# EAGLE design 617_jetracer_mini (EAGLE 9.6.2)
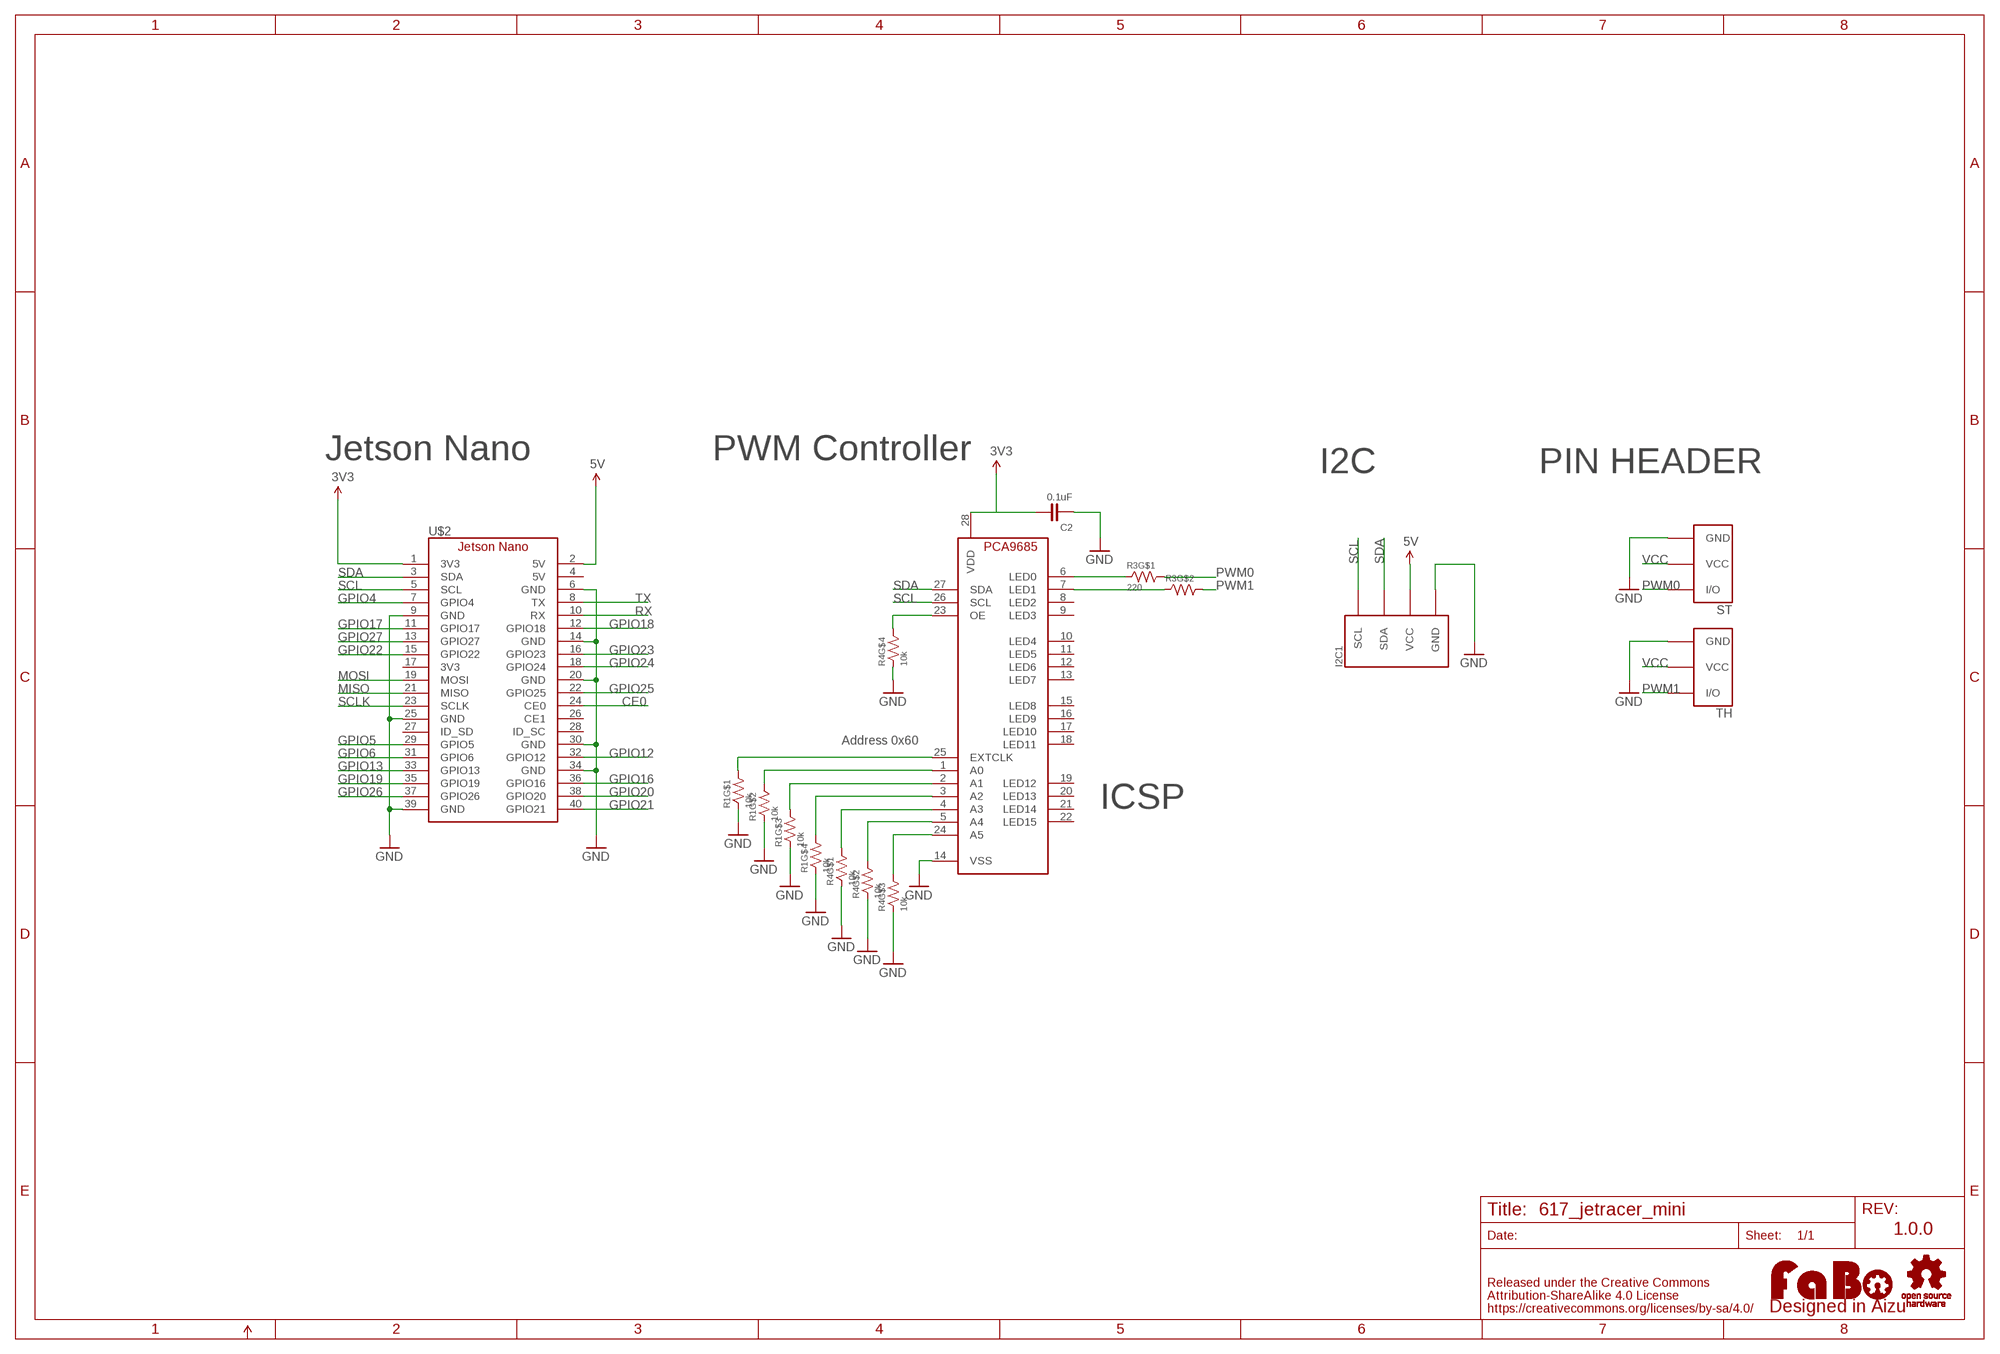
[diagram p0: schematic, sheet 1]

## Parts
C2  0.1uF  CAPACITOR-0603  [0603]
I2C1  FABO_BRICK_I2C-S04B-PASK-2  [FABO_BRICK_I2C_S04B-PASK-2]
LOGO1  LOGO_FABO-M  [LOGO_FABO_M]
R1  10k  RESISTOR_ARRAY  [EXBV8V]
R3  220  RESISTOR_ARRAY  [EXBV8V]
R4  10k  RESISTOR_ARRAY  [EXBV8V]
ST  FABO_BRICK_3PIN-HEADER  [FABO_BRICK_3PIN_HEADER]
TH  FABO_BRICK_3PIN-HEADER  [FABO_BRICK_3PIN_HEADER]
U$2  JETSON_NANO_NOBORDER  [JETSON_NANO_NOBOARDER]
U$3  PCA9685  [PCA9685]
U$5  LOGO_OSHW-M_BOTTOM  [LOGO_OSHW_M_BOTTOM]

## Nets
3V3: C2.2 U$2.1(3V3) U$3.28(VDD)
5V: I2C1.VCC U$2.2(5V)
CE0: U$2.24(CE0)
GND: C2.1 I2C1.GND R1.1 R1.2 R1.3 R1.4 R4.1 R4.2 R4.3 R4.4 ST.GND TH.GND U$2.6(GND) U$2.9(GND) U$2.14(GND) U$2.20(GND) U$2.25(GND) U$2.30(GND) U$2.34(GND) U$2.39(GND) U$3.14(VSS)
GPIO4: U$2.7(GPIO4)
GPIO5: U$2.29(GPIO5)
GPIO6: U$2.31(GPIO6)
GPIO12: U$2.32(GPIO12)
GPIO13: U$2.33(GPIO13)
GPIO16: U$2.36(GPIO16)
GPIO17: U$2.11(GPIO17)
GPIO18: U$2.12(GPIO18)
GPIO19: U$2.35(GPIO19)
GPIO20: U$2.38(GPIO20)
GPIO21: U$2.40(GPIO21)
GPIO22: U$2.15(GPIO22)
GPIO23: U$2.16(GPIO23)
GPIO24: U$2.18(GPIO24)
GPIO25: U$2.22(GPIO25)
GPIO26: U$2.37(GPIO26)
GPIO27: U$2.13(GPIO27)
MISO: U$2.21(MISO)
MOSI: U$2.19(MOSI)
N$2: R3.1 U$3.6(LED0)
N$3: R3.2 U$3.7(LED1)
N$7: R4.5 U$3.23(OE)
N$8: R1.8 U$3.25(EXTCLK)
N$9: R1.7 U$3.1(A0)
N$10: R1.6 U$3.2(A1)
N$11: R1.5 U$3.3(A2)
N$12: R4.8 U$3.4(A3)
N$13: R4.7 U$3.5(A4)
N$14: R4.6 U$3.24(A5)
PWM0: R3.8 ST.I/O
PWM1: R3.7 TH.I/O
RX: U$2.10(RX)
SCL: I2C1.SCL U$2.5(SCL) U$3.26(SCL)
SCLK: U$2.23(SCLK)
SDA: I2C1.SDA U$2.3(SDA) U$3.27(SDA)
TX: U$2.8(TX)
VCC: ST.VCC TH.VCC
Unconnected: R3.3 R3.4 R3.5 R3.6 U$2.4(5V) U$2.17(3V3) U$2.26(CE1) U$2.27(ID_SD) U$2.28(ID_SC) U$3.8(LED2) U$3.9(LED3) U$3.10(LED4) U$3.11(LED5) U$3.12(LED6) U$3.13(LED7) U$3.15(LED8) U$3.16(LED9) U$3.17(LED10) U$3.18(LED11) U$3.19(LED12) U$3.20(LED13) U$3.21(LED14) U$3.22(LED15)

## Notes on the sheet
- Jetson Nano | PWM Controller
- I2C | PIN HEADER
- Address 0x60
- ICSP
- 1.0.0

## Library data of the parts
C2 = FaBo-Capacitor:CAPACITOR: CAPACITOR
I2C1 = FaBo-Template:FABO_BRICK_I2C: FaBo Brick I2C
LOGO1 = component:LOGO_FABO
R1 R3 R4 = component:RESISTOR_ARRAY
ST TH = FaBo-Template:FABO_BRICK_3PIN: FaBo Brick 3pin
U$2 = FaBo-Boards:JETSON_NANO
U$3 = FaBo-Motor:PCA9685
U$5 = component:LOGO_OSHW

## Board
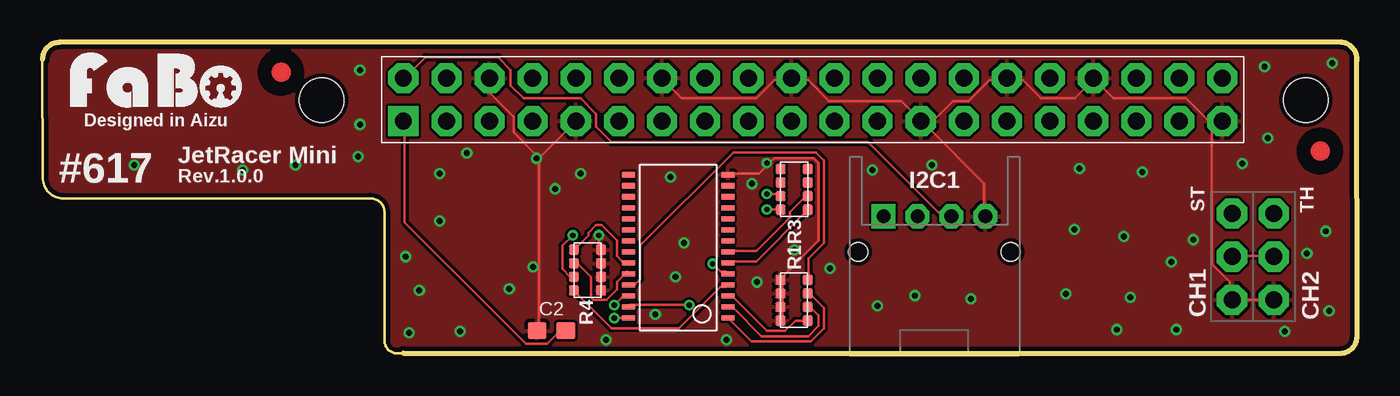
[diagram p1: board, top side]
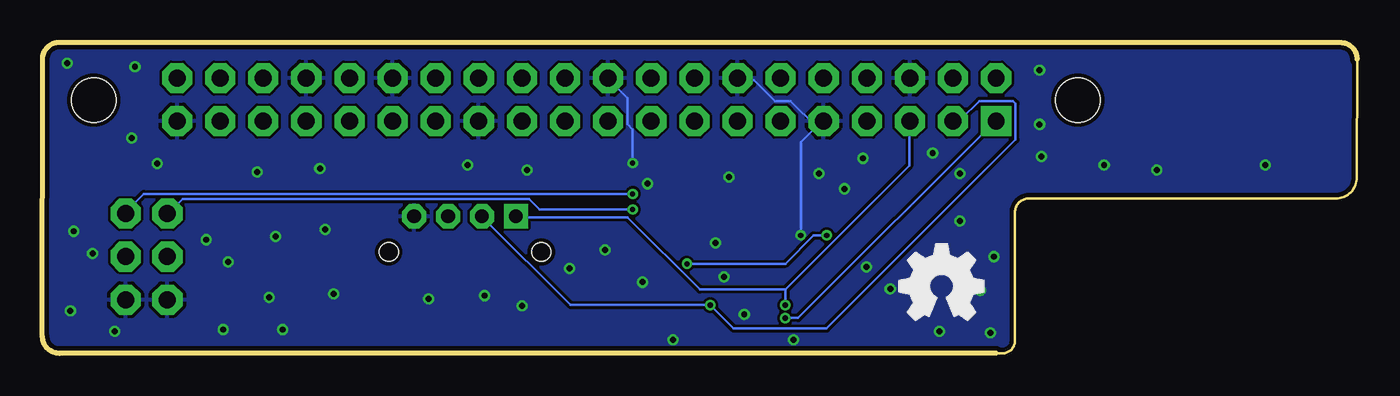
[diagram p2: board, bottom side, seen from below]

Size 77.46 x 18.34 mm. Coordinates in mm from the lower left corner, seen from the top.
Outline: 21.26,0 76.46,0 arc90 77.46,1 77.45,17.28 arc90 76.55,18.34 1,18.34 arc90 0,17.34 0.01,10.38 arc90 1.25,9.13 19.33,9.13 arc-90 20.16,8.31 20.16,0.73 arc90 20.89,0 21.41,0
Copper layers (1*16): Top 0.035mm / dielectric 1.6mm / Bottom 0.035mm
Design rules "PCBway": minimum track width 6mil, minimum drill 12mil, track to track 6mil, track to pad 6mil, pad to pad 6mil, via to via 6mil, smd to smd 6mil, copper to edge 10mil, drill to drill 10mil, minimum pad ring 10mil, minimum via ring 6mil, stop-mask expansion 2mil, vias tented up to drill 100mil, thermal gap 8mil
Holes 2.6 mm at 16.45,14.93 74.44,14.93

### Footprints (pad centres in the part's own frame; a part is rotated, then mirrored left to right if it is on the bottom)
0603 = smd 1.1 x 1: 1 -0.85,0; 2 0.85,0
FABO_BRICK_I2C_S04B-PASK-2 = drill 0.8 pad 1.422 octagon: GND -3,0; SDA 1,0; VCC -1,0 | drill 0.8 pad 1.422 square: SCL 3,0 | hole 1.1: 4.5,2.1; -4.5,2.1
EXBV8V = smd 0.6 x 0.6: 1 -1.2,-0.8; 2 -0.4,-0.8; 3 0.4,-0.8; 4 1.2,-0.8; 5 1.2,0.8; 6 0.4,0.8; 7 -0.4,0.8; 8 -1.2,0.8
FABO_BRICK_3PIN_HEADER = drill 1 pad 1.778 octagon: GND -2.54,0; I/O 2.54,0; VCC 0,0
JETSON_NANO_NOBOARDER = drill 1 pad 1.778 square: 1 1.27,1.27 | drill 1 pad 1.778 octagon: 2 1.27,3.81; 3 3.81,1.27; 4 3.81,3.81; 5 6.35,1.27; 6 6.35,3.81; 7 8.89,1.27; 8 8.89,3.81; 9 11.43,1.27; 10 11.43,3.81; 11 13.97,1.27; 12 13.97,3.81; 13 16.51,1.27; 14 16.51,3.81; 15 19.05,1.27; 16 19.05,3.81; 17 21.59,1.27; 18 21.59,3.81; 19 24.13,1.27; 20 24.13,3.81; 21 26.67,1.27; 22 26.67,3.81; 23 29.21,1.27; 24 29.21,3.81; 25 31.75,1.27; 26 31.75,3.81; 27 34.29,1.27; 28 34.29,3.81; 29 36.83,1.27; 30 36.83,3.81; 31 39.37,1.27; 32 39.37,3.81; 33 41.91,1.27; 34 41.91,3.81; 35 44.45,1.27; 36 44.45,3.81; 37 46.99,1.27; 38 46.99,3.81; 39 49.53,1.27; 40 49.53,3.81
PCA9685 = smd 0.3 x 0.75: 1 -4.15,-2.93; 2 -3.5,-2.93; 3 -2.85,-2.93; 4 -2.2,-2.93; 5 -1.55,-2.93; 6 -0.9,-2.93; 7 -0.25,-2.93; 8 0.4,-2.93; 9 1.05,-2.93; 10 1.7,-2.93; 11 2.35,-2.93; 12 3,-2.93; 13 3.65,-2.93; 14 4.3,-2.93; 15 4.3,2.92; 16 3.65,2.92; 17 3,2.92; 18 2.35,2.92; 19 1.7,2.92; 20 1.05,2.92; 21 0.4,2.92; 22 -0.25,2.92; 23 -0.9,2.92; 24 -1.55,2.92; 25 -2.2,2.92; 26 -2.85,2.92; 27 -3.5,2.92; 28 -4.15,2.92

### Placement (x,y rotation side)
C2  29.99,1.33 0 top
I2C1  52.56,8.08 180 top
LOGO1  6.69,14.12 0 top
R1  44.29,3.13 270 top
R3  44.29,9.67 90 top
R4  32.12,4.91 90 top
ST  70.1,5.7 90 top
TH  72.56,5.7 90 top
U$2  20,12.42 0 top
U$3  37.46,6.23 90 top
U$4  [MARK_POINT_3MM]  14.07,16.58 0 top
U$5  24.47,3.96 0 top
U$6  [MARK_POINT_3MM]  75.29,11.93 0 top

### Tracks (layer width: path | path; a pad name or v marks a point on that pad's centre or on a via)
3V3  (via drill 0.3)
  Top 0.152: v33.69,2.08 34.45,2.08 U$3.28 | C2.2 30.8,1.32 30.49,1.32 29.73,0.56 28.51,0.56 21.35,7.72 21.35,13.66 U$2.1
  Bottom 0.152: v33.69,2.08 32.93,2.08 21.35,13.66 U$2.1
5V
  Top 0.152: I2C1.VCC 53.5,8.18 52.89,8.18 48.63,12.45 33.54,12.45 32.62,13.36 32.62,14.12 31.71,15.04 28.36,15.04 27.59,15.8 27.59,16.71 26.83,17.47 22.57,17.47 21.35,16.26 U$2.2
GND  (via drill 0.3, 0.35)
  Top 0.152: R1.4 43.6,2.08 43.6,2.69 R1.3 43.6,2.84 43.6,3.45 R1.2 43.6,3.61 43.6,4.22 R1.1 43.44,4.37 45.73,6.65 45.73,11.23 45.43,11.53 43.14,11.53 42.68,11.07 | 42.68,11.07 42.23,10.62 40.4,10.62 U$3.14 | R4.1 32.93,3.76 32.93,4.37 R4.2 32.93,4.52 32.93,5.28 R4.3 32.93,5.43 32.93,6.04 R4.4 32.78,6.2 v32.78,6.96 | 29.27,11.53 29.27,1.47 C2.1 | 29.27,11.53 31.4,13.66 U$2.9 | 29.27,11.53 27.75,13.05 27.75,13.97 26.38,15.34 26.38,16.1 U$2.6 | U$2.14 36.59,16.1 37.65,15.04 42.07,15.04 43.14,16.1 44.05,16.1 U$2.20 44.21,16.1 45.12,16.1 46.34,14.88 50.61,14.88 51.67,13.82 U$2.25 | v42.68,11.23 42.68,11.07 | 52.13,13.36 51.83,13.66 U$2.25 | 52.13,13.36 55.48,10.01 55.48,8.18 I2C1.GND | 52.13,13.36 53.66,14.88 54.57,14.88 55.79,16.1 56.7,16.1 U$2.30 56.86,16.1 57.77,16.1 58.84,15.04 60.82,15.04 61.88,16.1 U$2.34 62.04,16.1 63.1,15.04 67.37,15.04 68.59,13.82 68.9,13.82 | 52.13,13.36 U$2.25 | TH.GND 72.55,3.15 70.11,3.15 ST.GND 69.96,3.3 69.96,4.22 68.9,5.28 68.9,13.82 | 68.9,13.82 69.5,13.82 U$2.39 68.9,13.82
  Bottom 0.152: v32.78,6.96 32.78,12.45 31.86,13.36 | 31.86,13.36 31.56,13.66 U$2.9 31.86,13.36 | 31.86,13.36 33.39,14.88 34.3,14.88 35.52,16.1 36.43,16.1 U$2.14 | v42.68,11.23 42.68,13.21 42.99,13.51 42.99,15.04 44.05,16.1 U$2.20
  other vias: 37.81,6.5 37.31,4.5 36.11,2.3 28.91,5.1 27.51,3.8 44.31,6.1 42.11,4.2 46.41,5 41.81,10 37.01,10.4 31.71,10.6 23.41,10.6 23.41,7.8 22.21,3.7 18.61,11.6 5.41,11.1 11.81,10.8 18.71,16.7 29.11,11.5 25.01,11.8 49.21,2.8 52.41,11.1 48.91,10.8 54.71,3.2 51.41,3.4 64.81,10.7 63.71,6.9 66.51,5.4 64.11,3.3 60.31,3.5 60.81,7.3 61.11,10.9 70.71,11.2 75.61,7.2 75.81,2.5 73.21,1.3 66.81,1.4 63.31,1.4 72.01,16.9 76.01,17.1 72.21,12.7 67.81,6.7 74.51,5.9 33.21,0.8 40.31,0.8 24.61,1.3 21.61,1.2 21.41,5.7 14.91,11.1 18.71,13.5 30.21,9.7
  pour Top: -0.29,-1.12 78.45,-1.12 78.45,19.2 -0.29,19.2
  pour Bottom: -0.29,-1.12 78.45,-1.12 78.45,19.2 -0.29,19.2
N$2
  Top 0.152: R3.1 44.97,8.33 42.07,5.43 40.4,5.43 U$3.6
N$3
  Top 0.152: R3.2 44.97,9.24 44.05,8.33 44.05,8.03 42.07,6.04 40.4,6.04 U$3.7
N$7
  Top 0.152: R4.5 31.4,6.2 32.17,6.96 32.17,7.11 32.62,7.57 32.93,7.57 33.84,6.65 33.84,5.74 34.15,5.43 34.45,5.43 U$3.23
N$8
  Top 0.152: R1.8 45.12,4.37 45.12,5.59 46.04,6.5 46.04,11.38 45.58,11.84 40.7,11.84 35.21,6.35 35.21,4.37 34.91,4.06 34.61,4.06 U$3.25
N$9
  Top 0.152: R1.7 45.12,3.45 45.27,3.45 46.04,2.69 46.04,1.47 45.27,0.71 41.77,0.71 40.4,2.08 U$3.1
N$10
  Top 0.152: R1.6 45.12,2.69 45.27,2.69 45.73,2.23 45.73,1.62 45.12,1.02 42.38,1.02 40.7,2.69 40.4,2.69 U$3.2
N$11
  Top 0.152: R1.5 44.97,1.93 44.36,1.93 43.75,1.32 42.68,1.32 40.7,3.3 40.4,3.3 U$3.3
N$12
  Top 0.152: R4.8 31.4,3.61 33.54,1.47 37.5,1.47 39.94,3.91 40.24,3.91 U$3.4
N$13  (via drill 0.3)
  Top 0.152: v31.25,6.96 30.64,6.35 30.64,4.98 31.1,4.52 31.25,4.52 R4.7 | v39.48,5.28 39.94,4.83 40.24,4.83 U$3.5
  Bottom 0.152: v31.25,6.96 32.01,6.96 33.69,5.28 v39.48,5.28
N$14
  Top 0.152: R4.6 31.4,5.28 31.56,5.28 32.32,4.52 32.32,3.3 32.47,3.15 33.23,3.15 33.84,3.76 33.84,4.22 34.45,4.83 U$3.24
PWM0  (via drill 0.3)
  Top 0.152: v42.68,8.48 43.44,8.48 R3.8
  Bottom 0.152: v42.68,8.48 48.17,8.48 48.78,9.09 69.2,9.09 69.96,8.33 ST.I/O
PWM1  (via drill 0.3)
  Top 0.152: v42.68,9.4 43.44,9.4 R3.7
  Bottom 0.152: v42.68,9.4 71.49,9.4 72.55,8.33 TH.I/O
SCL  (via drill 0.3)
  Top 0.152: v33.69,2.84 34.15,3.3 34.45,3.3 U$3.26
  Bottom 0.152: 33.69,3.76 v33.69,2.84 | 33.69,3.76 26.38,11.07 26.38,13.66 U$2.5 | 33.69,3.76 38.72,3.76 42.99,8.03 49.54,8.03 I2C1.SCL
SDA  (via drill 0.3)
  Top 0.152: v38.11,2.84 34.61,2.84 U$3.27
  Bottom 0.152: I2C1.SDA 51.52,8.03 46.34,2.84 v38.11,2.84 36.74,1.47 31.25,1.47 20.13,12.6 20.13,14.73 20.28,14.88 22.26,14.88 23.33,13.82 23.78,13.82 U$2.3
VCC
  Top 0.152: ST.VCC 70.11,5.74 72.55,5.74 TH.VCC

### Text on the board
tPlace: Designed in Aizu | JetRacer Mini | #617 | Rev.1.0.0 | CH1 | CH2